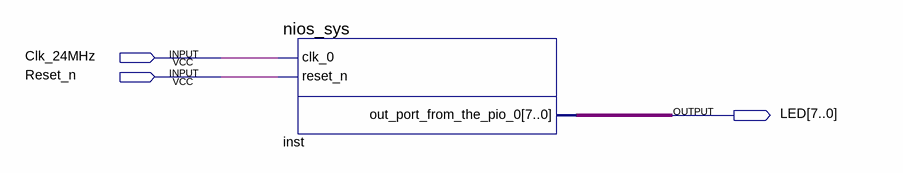
[diagram p0: schematic sheet]
// Quartus schematic aca_nios_intro.bdf as structural Verilog: 1 symbols, 3 pins
module aca_nios_intro (
  input  Clk_24MHz,
  input  Reset_n,
  output [7:0] LED
);

  nios_sys inst (.clk_0(Clk_24MHz), .reset_n(Reset_n), .out_port_from_the_pio_0(LED));
endmodule
